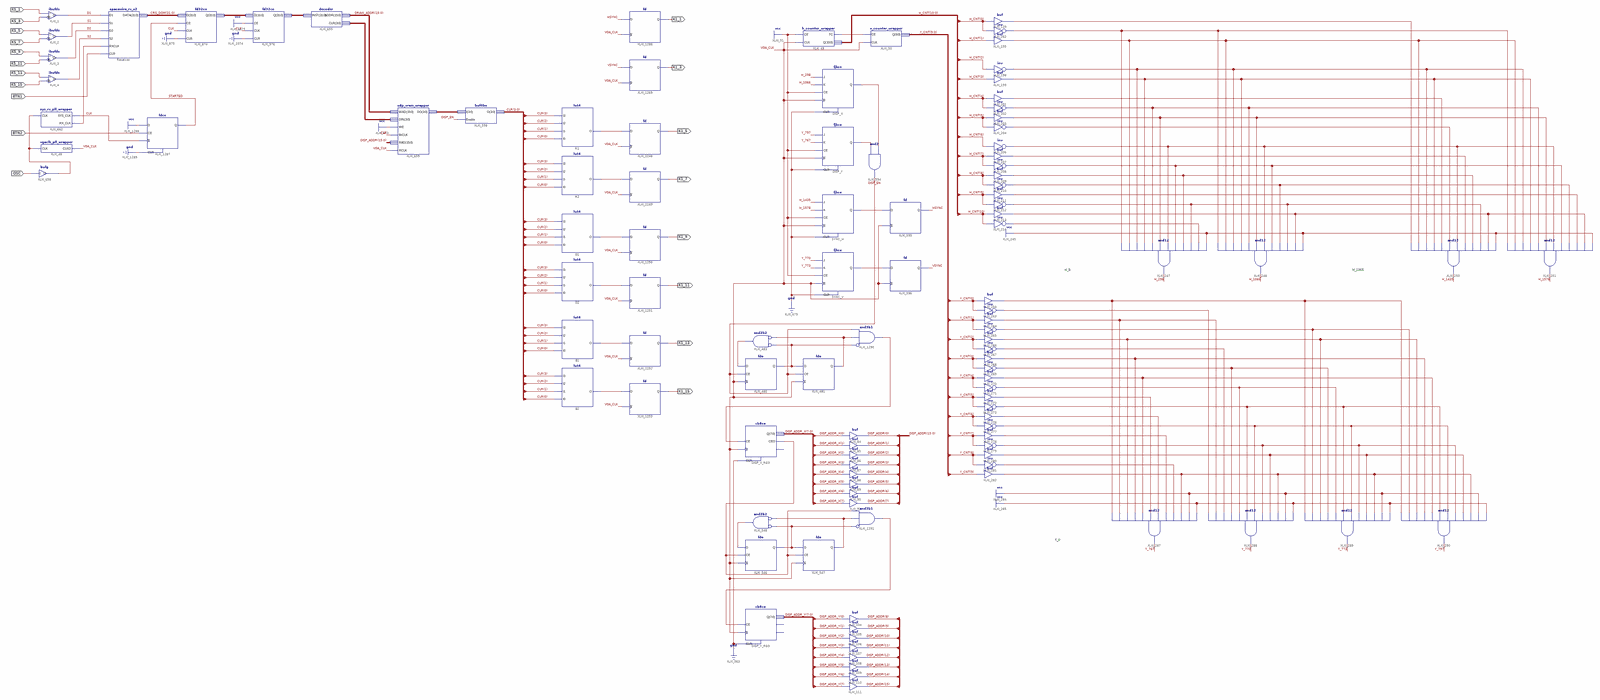
[diagram p0: schematic sheet 1, whole]
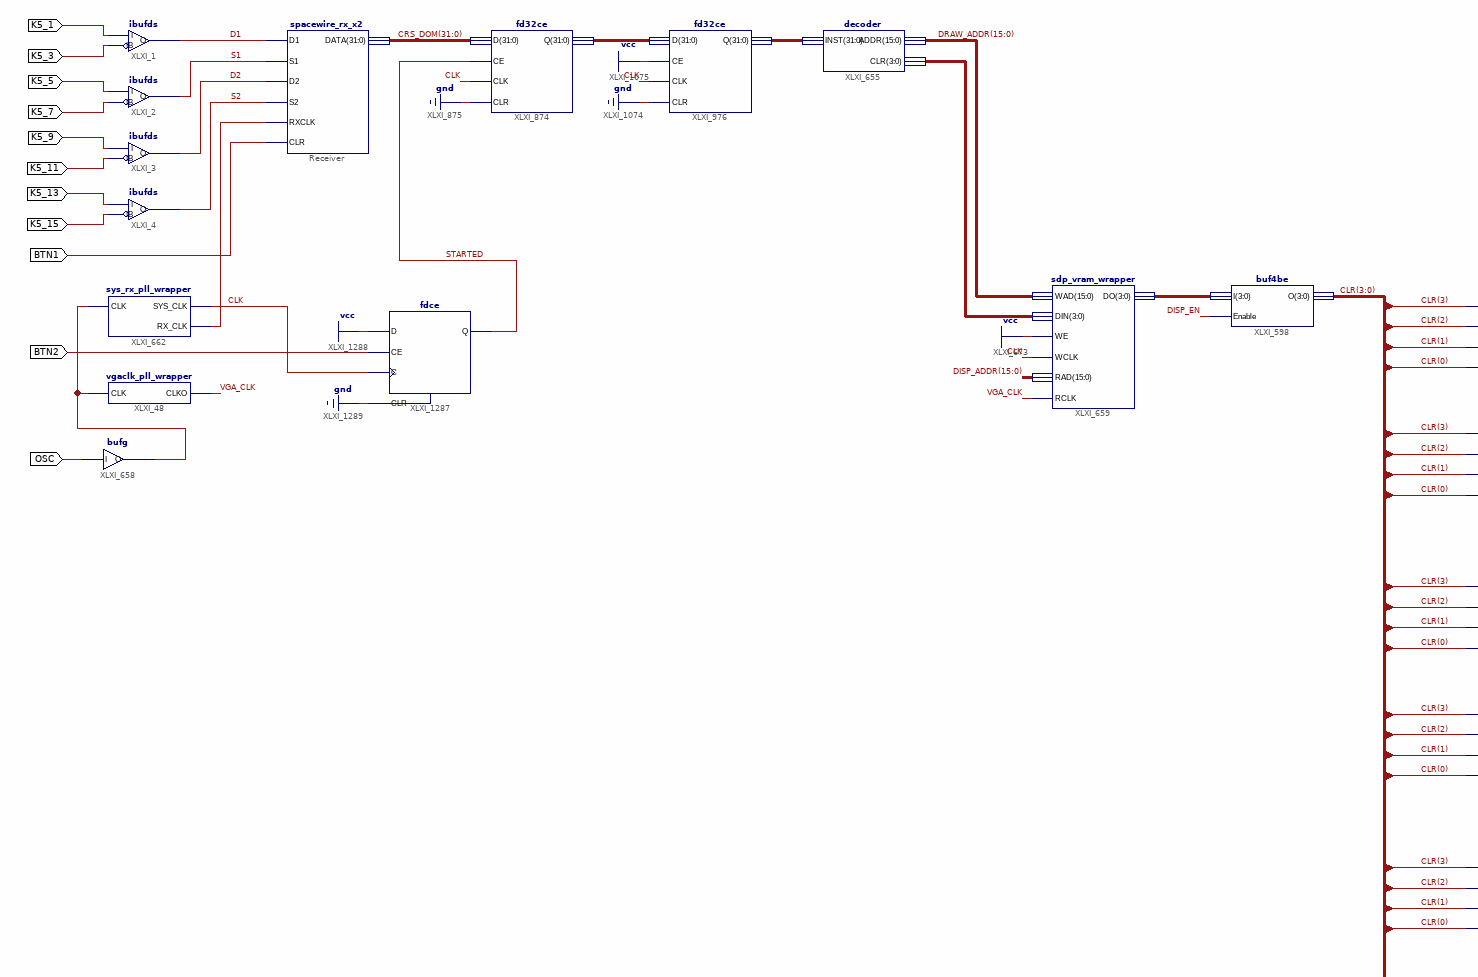
[diagram p1: schematic sheet 1, upper left part]
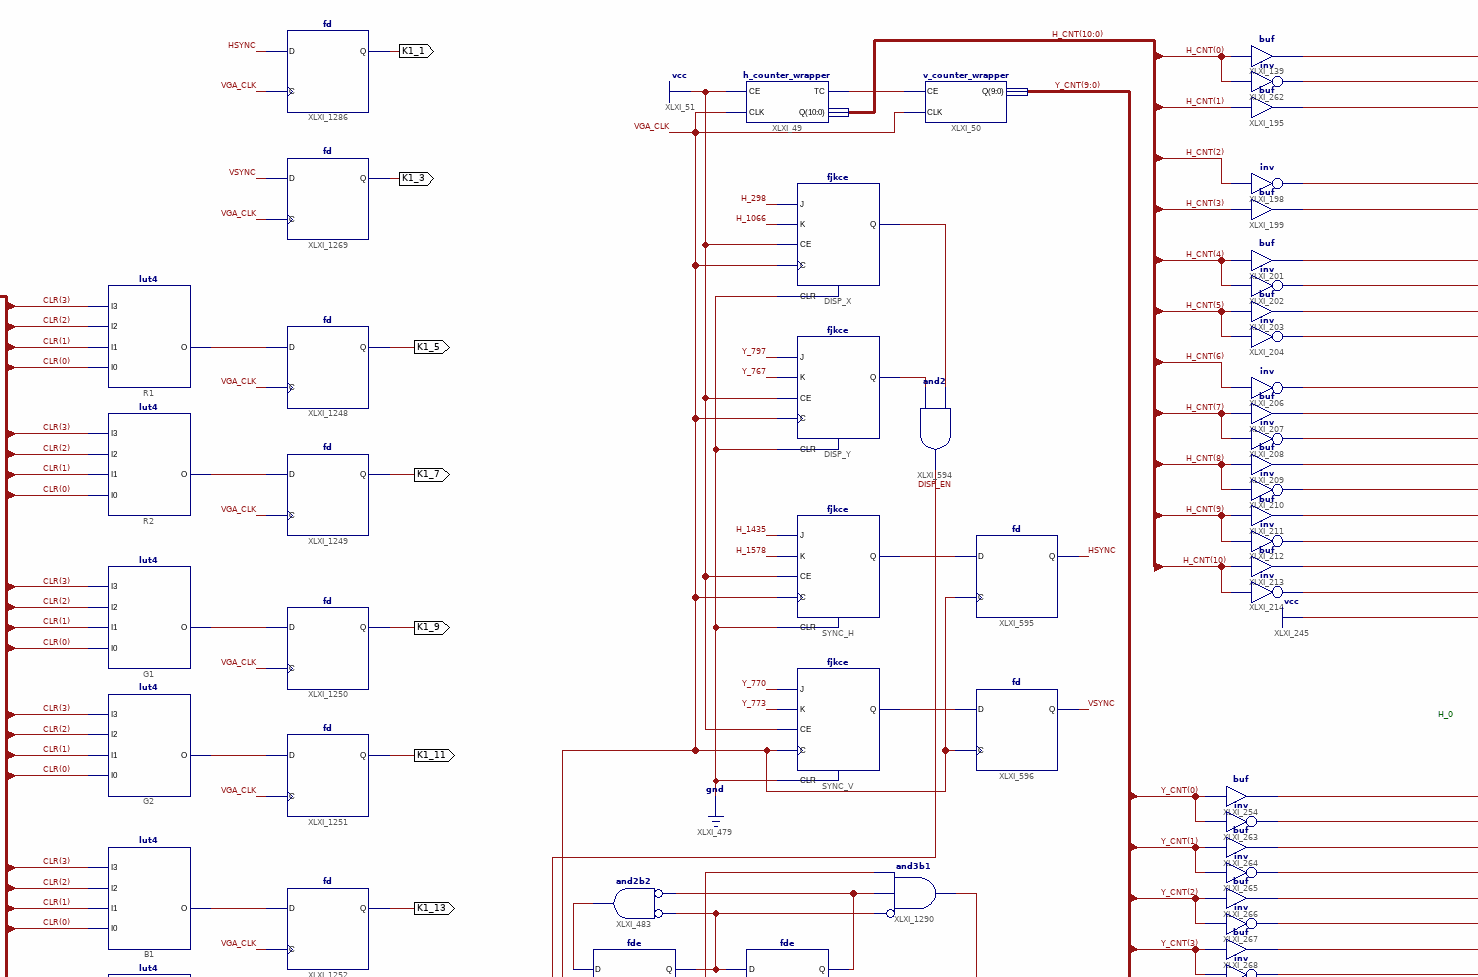
[diagram p2: schematic sheet 1, upper centre part]
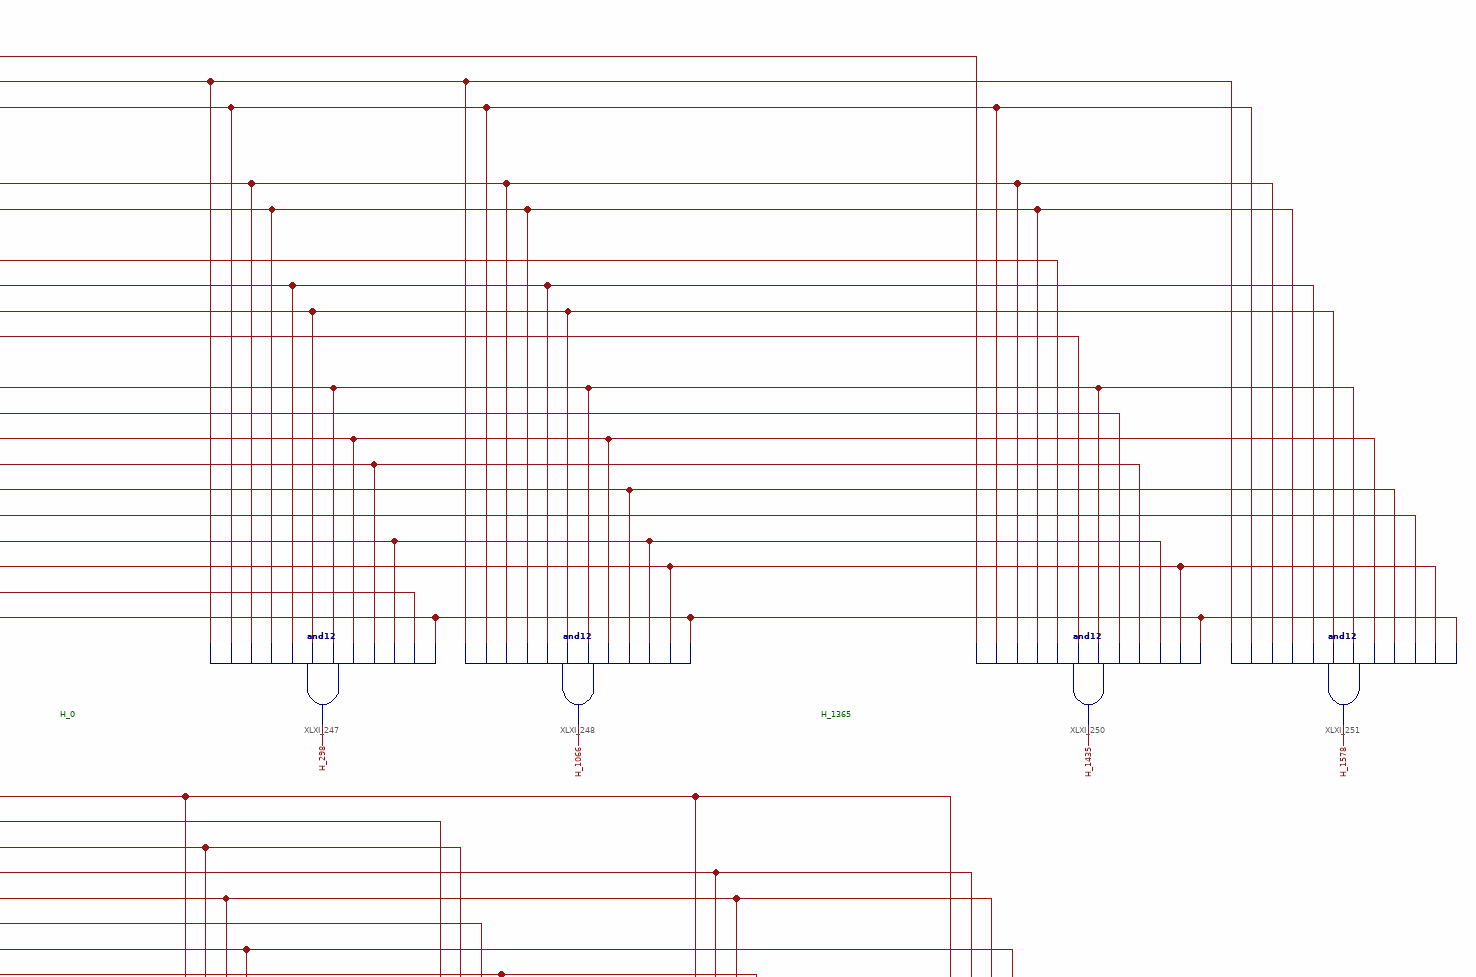
[diagram p3: schematic sheet 1, upper right part]
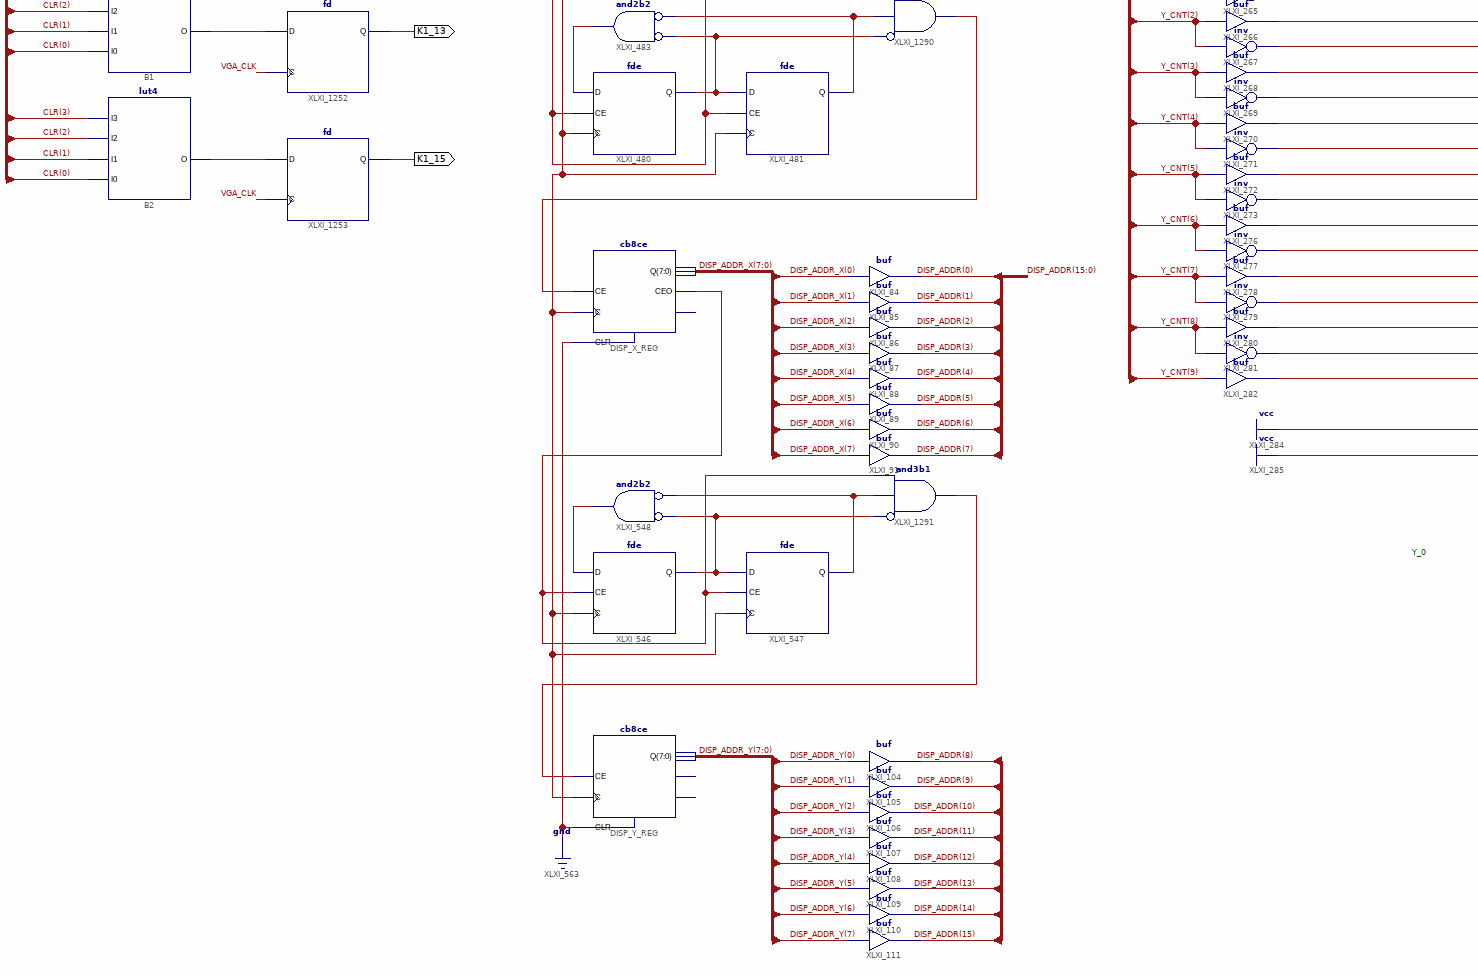
[diagram p4: schematic sheet 1, lower centre part]
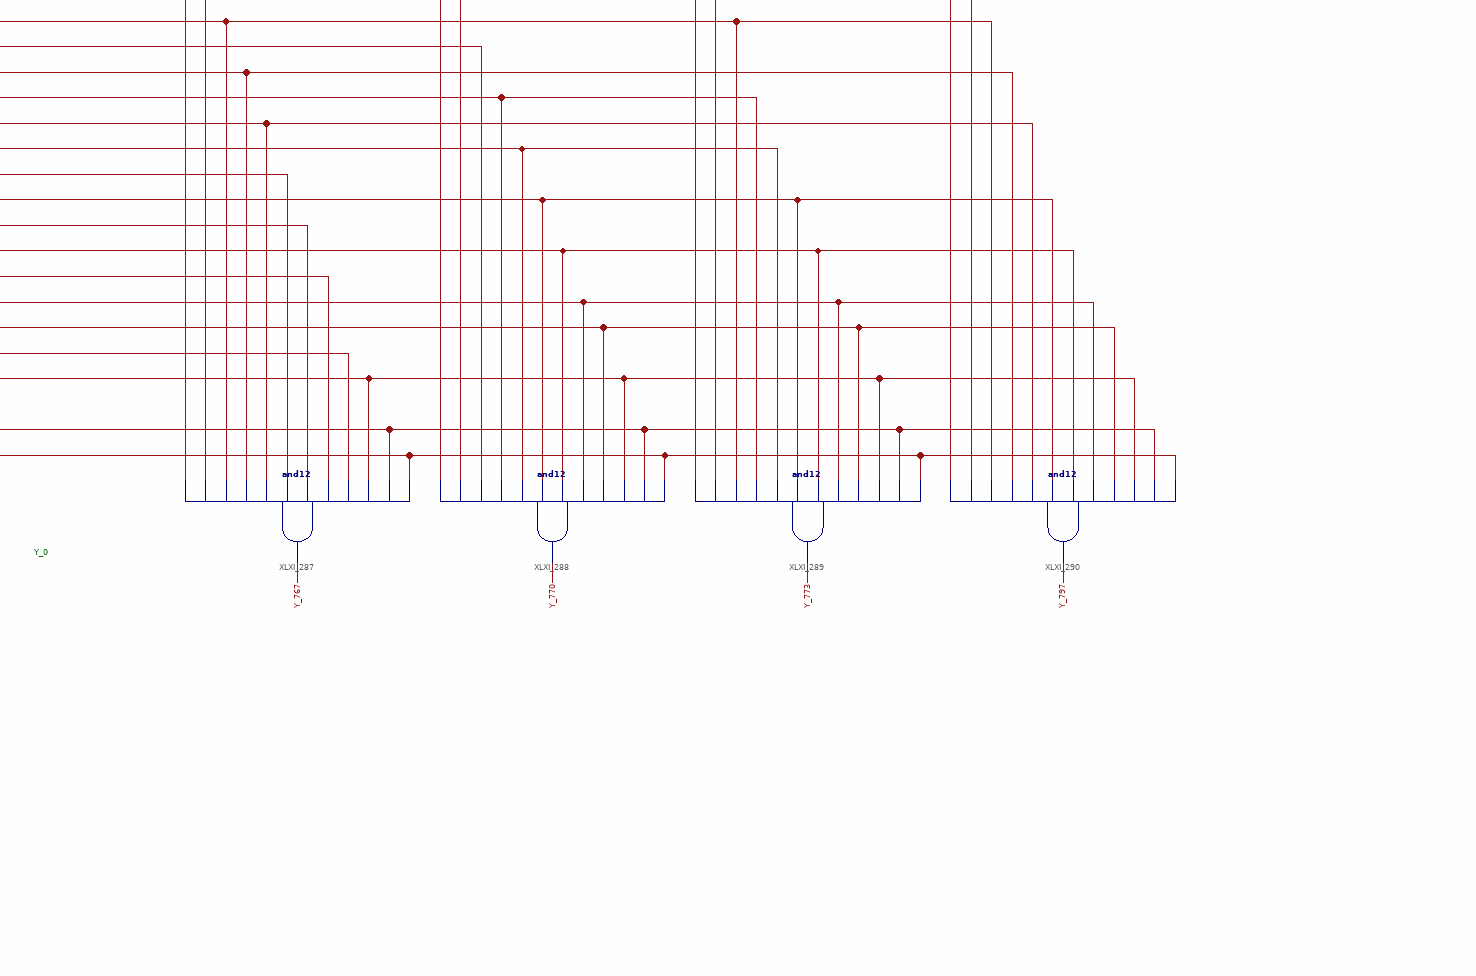
[diagram p5: schematic sheet 1, lower right part]
// Xilinx ISE schematic main.sch (spartan6) as structural Verilog: 108 symbols, 19 ports
module main (
  input  K5_1,
  input  K5_3,
  input  K5_5,
  input  K5_7,
  input  K5_9,
  input  K5_11,
  input  K5_13,
  input  K5_15,
  input  OSC,
  input  BTN1,
  input  BTN2,
  output K1_5,
  output K1_7,
  output K1_9,
  output K1_11,
  output K1_13,
  output K1_15,
  output K1_3,
  output K1_1
);

  wire CLK, D1, D2, DISP_EN, H_298, H_1066, H_1435, H_1578, HSYNC, S1, S2, STARTED, VGA_CLK, VSYNC, XLXN_77,
       XLXN_120, XLXN_339, XLXN_341, XLXN_344, XLXN_347, XLXN_348, XLXN_349, XLXN_350, XLXN_352, XLXN_353,
       XLXN_354, XLXN_355, XLXN_356, XLXN_357, XLXN_358, XLXN_359, XLXN_361, XLXN_374, XLXN_376, XLXN_404,
       XLXN_405, XLXN_406, XLXN_407, XLXN_408, XLXN_409, XLXN_410, XLXN_411, XLXN_412, XLXN_413, XLXN_414,
       XLXN_415, XLXN_416, XLXN_418, XLXN_419, XLXN_420, XLXN_421, XLXN_422, XLXN_423, XLXN_701, XLXN_702,
       XLXN_703, XLXN_772, XLXN_793, XLXN_794, XLXN_795, XLXN_817, XLXN_936, XLXN_937, XLXN_939, XLXN_940,
       XLXN_1271, XLXN_2449, XLXN_2450, XLXN_2451, XLXN_2452, XLXN_2453, XLXN_2454, XLXN_2471, Y_767, Y_770,
       Y_773, Y_797;
  wire [3:0] CLR, XLXN_957, XLXN_1248;
  wire [7:0] DISP_ADDR_X, DISP_ADDR_Y;
  wire [9:0] Y_CNT;
  wire [10:0] H_CNT;
  wire [15:0] DISP_ADDR, DRAW_ADDR;
  wire [31:0] CRS_DOM, XLXN_2204, XLXN_2205;

  ibufds #(.DIFF_TERM("TRUE")) XLXI_1 (.I(K5_1), .IB(K5_3), .O(D1));
  ibufds #(.DIFF_TERM("TRUE")) XLXI_2 (.I(K5_5), .IB(K5_7), .O(S1));
  ibufds #(.DIFF_TERM("TRUE")) XLXI_3 (.I(K5_9), .IB(K5_11), .O(D2));
  ibufds #(.DIFF_TERM("TRUE")) XLXI_4 (.I(K5_13), .IB(K5_15), .O(S2));
  vgaclk_pll_wrapper XLXI_48 (.CLK(XLXN_1271), .CLKO(VGA_CLK));
  bufg XLXI_658 (.I(OSC), .O(XLXN_1271));
  sys_rx_pll_wrapper XLXI_662 (.CLK(XLXN_1271), .RX_CLK(XLXN_77), .SYS_CLK(CLK));
  spacewire_rx_x2 Receiver (.CLR(BTN1), .D1(D1), .D2(D2), .DATA(CRS_DOM), .RXCLK(XLXN_77), .S1(S1), .S2(S2));
  fd32ce XLXI_874 (.CE(STARTED), .CLK(CLK), .CLR(1'b0), .D(CRS_DOM), .Q(XLXN_2204));
  decoder XLXI_655 (.ADDR(DRAW_ADDR), .CLR(XLXN_1248), .INST(XLXN_2205));
  fd32ce XLXI_976 (.CE(1'b1), .CLK(CLK), .CLR(1'b0), .D(XLXN_2204), .Q(XLXN_2205));
  h_counter_wrapper XLXI_49 (.CE(1'b1), .CLK(VGA_CLK), .Q(H_CNT), .TC(XLXN_120));
  v_counter_wrapper XLXI_50 (.CE(XLXN_120), .CLK(VGA_CLK), .Q(Y_CNT));
  buf XLXI_139 (XLXN_339, H_CNT[0]);
  buf XLXI_195 (XLXN_341, H_CNT[1]);
  not XLXI_198 (XLXN_344, H_CNT[2]);
  buf XLXI_199 (XLXN_374, H_CNT[3]);
  buf XLXI_201 (XLXN_347, H_CNT[4]);
  not XLXI_202 (XLXN_348, H_CNT[4]);
  buf XLXI_203 (XLXN_349, H_CNT[5]);
  not XLXI_204 (XLXN_350, H_CNT[5]);
  not XLXI_206 (XLXN_352, H_CNT[6]);
  buf XLXI_207 (XLXN_353, H_CNT[7]);
  not XLXI_208 (XLXN_354, H_CNT[7]);
  buf XLXI_209 (XLXN_355, H_CNT[8]);
  not XLXI_210 (XLXN_356, H_CNT[8]);
  buf XLXI_211 (XLXN_357, H_CNT[9]);
  not XLXI_212 (XLXN_358, H_CNT[9]);
  buf XLXI_213 (XLXN_359, H_CNT[10]);
  not XLXI_214 (XLXN_361, H_CNT[10]);
  and XLXI_247 (H_298, XLXN_376, XLXN_341, XLXN_344, XLXN_374, XLXN_348, XLXN_349, XLXN_352, XLXN_354, XLXN_355, XLXN_358, XLXN_361, 1'b1);
  and XLXI_248 (H_1066, XLXN_376, XLXN_341, XLXN_344, XLXN_374, XLXN_348, XLXN_349, XLXN_352, XLXN_354, XLXN_356, XLXN_358, XLXN_359, 1'b1);
  and XLXI_250 (H_1435, XLXN_339, XLXN_341, XLXN_344, XLXN_374, XLXN_347, XLXN_350, XLXN_352, XLXN_353, XLXN_355, XLXN_358, XLXN_359, 1'b1);
  and XLXI_251 (H_1578, XLXN_376, XLXN_341, XLXN_344, XLXN_374, XLXN_348, XLXN_349, XLXN_352, XLXN_354, XLXN_356, XLXN_357, XLXN_359, 1'b1);
  buf XLXI_254 (XLXN_404, Y_CNT[0]);
  not XLXI_262 (XLXN_376, H_CNT[0]);
  not XLXI_263 (XLXN_405, Y_CNT[0]);
  buf XLXI_264 (XLXN_406, Y_CNT[1]);
  not XLXI_265 (XLXN_407, Y_CNT[1]);
  buf XLXI_266 (XLXN_408, Y_CNT[2]);
  not XLXI_267 (XLXN_409, Y_CNT[2]);
  buf XLXI_268 (XLXN_410, Y_CNT[3]);
  not XLXI_269 (XLXN_411, Y_CNT[3]);
  buf XLXI_270 (XLXN_412, Y_CNT[4]);
  not XLXI_271 (XLXN_413, Y_CNT[4]);
  buf XLXI_272 (XLXN_414, Y_CNT[5]);
  not XLXI_273 (XLXN_415, Y_CNT[5]);
  buf XLXI_276 (XLXN_416, Y_CNT[6]);
  not XLXI_277 (XLXN_418, Y_CNT[6]);
  buf XLXI_278 (XLXN_419, Y_CNT[7]);
  not XLXI_279 (XLXN_420, Y_CNT[7]);
  buf XLXI_280 (XLXN_421, Y_CNT[8]);
  not XLXI_281 (XLXN_422, Y_CNT[8]);
  buf XLXI_282 (XLXN_423, Y_CNT[9]);
  and XLXI_287 (Y_767, XLXN_404, XLXN_406, XLXN_408, XLXN_410, XLXN_412, XLXN_414, XLXN_416, XLXN_419, XLXN_422, XLXN_423, 1'b1, 1'b1);
  and XLXI_289 (Y_773, XLXN_404, XLXN_407, XLXN_408, XLXN_411, XLXN_413, XLXN_415, XLXN_418, XLXN_420, XLXN_421, XLXN_423, 1'b1, 1'b1);
  and XLXI_288 (Y_770, XLXN_405, XLXN_406, XLXN_409, XLXN_411, XLXN_413, XLXN_415, XLXN_418, XLXN_420, XLXN_421, XLXN_423, 1'b1, 1'b1);
  and XLXI_290 (Y_797, XLXN_404, XLXN_407, XLXN_408, XLXN_410, XLXN_412, XLXN_415, XLXN_418, XLXN_420, XLXN_421, XLXN_423, 1'b1, 1'b1);
  fjkce DISP_X (.C(VGA_CLK), .CE(1'b1), .CLR(1'b0), .J(H_298), .K(H_1066), .Q(XLXN_937));
  fjkce SYNC_H (.C(VGA_CLK), .CE(1'b1), .CLR(1'b0), .J(H_1435), .K(H_1578), .Q(XLXN_939));
  fjkce SYNC_V (.C(VGA_CLK), .CE(1'b1), .CLR(1'b0), .J(Y_770), .K(Y_773), .Q(XLXN_940));
  fjkce DISP_Y (.C(VGA_CLK), .CE(1'b1), .CLR(1'b0), .J(Y_797), .K(Y_767), .Q(XLXN_936));
  cb8ce DISP_X_REG (.C(VGA_CLK), .CE(XLXN_772), .CLR(1'b0), .CEO(XLXN_2471), .Q(DISP_ADDR_X));  // open: TC
  buf XLXI_84 (DISP_ADDR[0], DISP_ADDR_X[0]);
  buf XLXI_85 (DISP_ADDR[1], DISP_ADDR_X[1]);
  buf XLXI_86 (DISP_ADDR[2], DISP_ADDR_X[2]);
  buf XLXI_87 (DISP_ADDR[3], DISP_ADDR_X[3]);
  buf XLXI_88 (DISP_ADDR[4], DISP_ADDR_X[4]);
  buf XLXI_89 (DISP_ADDR[5], DISP_ADDR_X[5]);
  buf XLXI_90 (DISP_ADDR[6], DISP_ADDR_X[6]);
  buf XLXI_91 (DISP_ADDR[7], DISP_ADDR_X[7]);
  fde XLXI_480 (.C(VGA_CLK), .CE(DISP_EN), .D(XLXN_703), .Q(XLXN_701));
  fde XLXI_481 (.C(VGA_CLK), .CE(DISP_EN), .D(XLXN_701), .Q(XLXN_702));
  and XLXI_483 (XLXN_703, ~XLXN_702, ~XLXN_701);  // and2b2
  fde XLXI_546 (.C(VGA_CLK), .CE(XLXN_2471), .D(XLXN_794), .Q(XLXN_795));
  fde XLXI_547 (.C(VGA_CLK), .CE(XLXN_2471), .D(XLXN_795), .Q(XLXN_793));
  and XLXI_548 (XLXN_794, ~XLXN_793, ~XLXN_795);  // and2b2
  buf XLXI_104 (DISP_ADDR[8], DISP_ADDR_Y[0]);
  buf XLXI_105 (DISP_ADDR[9], DISP_ADDR_Y[1]);
  buf XLXI_106 (DISP_ADDR[10], DISP_ADDR_Y[2]);
  buf XLXI_107 (DISP_ADDR[11], DISP_ADDR_Y[3]);
  buf XLXI_108 (DISP_ADDR[12], DISP_ADDR_Y[4]);
  buf XLXI_109 (DISP_ADDR[13], DISP_ADDR_Y[5]);
  buf XLXI_110 (DISP_ADDR[14], DISP_ADDR_Y[6]);
  buf XLXI_111 (DISP_ADDR[15], DISP_ADDR_Y[7]);
  cb8ce DISP_Y_REG (.C(VGA_CLK), .CE(XLXN_817), .CLR(1'b0), .Q(DISP_ADDR_Y));  // open: CEO, TC
  and XLXI_594 (DISP_EN, XLXN_936, XLXN_937);
  fd XLXI_595 (.C(VGA_CLK), .D(XLXN_939), .Q(HSYNC));
  fd XLXI_596 (.C(VGA_CLK), .D(XLXN_940), .Q(VSYNC));
  lut4 #(.INIT("E7D0")) R2 (.I0(CLR[0]), .I1(CLR[1]), .I2(CLR[2]), .I3(CLR[3]), .O(XLXN_2453));
  lut4 #(.INIT("6EB8")) G1 (.I0(CLR[0]), .I1(CLR[1]), .I2(CLR[2]), .I3(CLR[3]), .O(XLXN_2452));
  lut4 #(.INIT("9CC0")) G2 (.I0(CLR[0]), .I1(CLR[1]), .I2(CLR[2]), .I3(CLR[3]), .O(XLXN_2451));
  lut4 #(.INIT("1DA6")) B1 (.I0(CLR[0]), .I1(CLR[1]), .I2(CLR[2]), .I3(CLR[3]), .O(XLXN_2450));
  lut4 #(.INIT("F0C0")) B2 (.I0(CLR[0]), .I1(CLR[1]), .I2(CLR[2]), .I3(CLR[3]), .O(XLXN_2449));
  lut4 #(.INIT("C7A4")) R1 (.I0(CLR[0]), .I1(CLR[1]), .I2(CLR[2]), .I3(CLR[3]), .O(XLXN_2454));
  fd XLXI_1248 (.C(VGA_CLK), .D(XLXN_2454), .Q(K1_5));
  fd XLXI_1249 (.C(VGA_CLK), .D(XLXN_2453), .Q(K1_7));
  fd XLXI_1250 (.C(VGA_CLK), .D(XLXN_2452), .Q(K1_9));
  fd XLXI_1251 (.C(VGA_CLK), .D(XLXN_2451), .Q(K1_11));
  fd XLXI_1252 (.C(VGA_CLK), .D(XLXN_2450), .Q(K1_13));
  fd XLXI_1253 (.C(VGA_CLK), .D(XLXN_2449), .Q(K1_15));
  sdp_vram_wrapper XLXI_659 (
    .DIN(XLXN_1248), .DO(XLXN_957), .RAD(DISP_ADDR), .RCLK(VGA_CLK), .WAD(DRAW_ADDR), .WCLK(CLK), .WE(1'b1));
  buf4be XLXI_598 (.Enable(DISP_EN), .I(XLXN_957), .O(CLR));
  fd XLXI_1269 (.C(VGA_CLK), .D(VSYNC), .Q(K1_3));
  fd XLXI_1286 (.C(VGA_CLK), .D(HSYNC), .Q(K1_1));
  fdce XLXI_1287 (.C(CLK), .CE(BTN2), .CLR(1'b0), .D(1'b1), .Q(STARTED));
  and XLXI_1290 (XLXN_772, ~XLXN_701, XLXN_702, DISP_EN);  // and3b1
  and XLXI_1291 (XLXN_817, ~XLXN_795, XLXN_793, XLXN_2471);  // and3b1

  // Notes on the sheet:
  //   H_0
  //   H_1365
  //   Y_0
endmodule
